# Altium schematic sheet Motor_Controller.SchDoc
size A4; DocumentNumber: 3; SheetNumber: 3; SheetTotal: 4
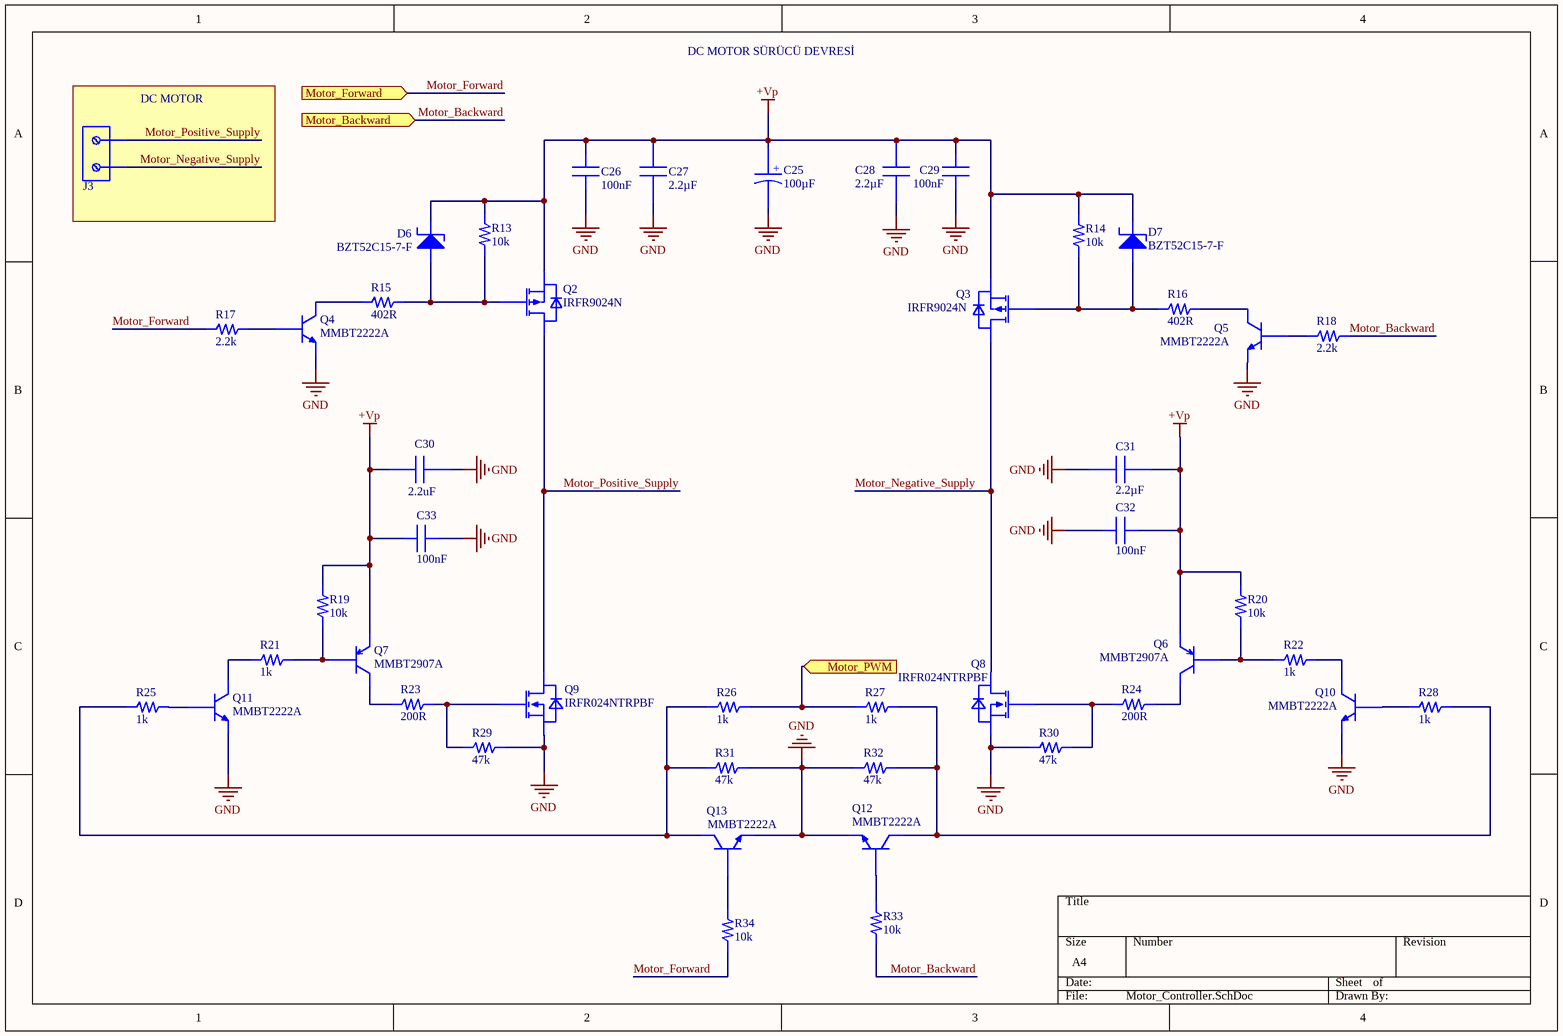
[diagram p0: Motor_Controller.SchDoc]

## Parts
C25  100µF  [CAP_EEHZA1H101P]
C26  100nF  [CL21B104KBCNNNC]
C27  2.2µF  [CAPC3216X180N]
C28  2.2µF  [CAPC3216X180N]
C29  100nF  [CL21B104KBCNNNC]
C30  2.2µF  [CAPC3216X180N]  (value not drawn)
C31  2.2µF  [CAPC3216X180N]
C32  100nF  [CL21B104KBCNNNC]
C33  100nF  [CL21B104KBCNNNC]
D6  BZT52C15-7-F  [DIODE ZENER BZT52C15-7-F]
D7  BZT52C15-7-F  [DIODE ZENER BZT52C15-7-F]
J3  2x1 5mm T.B.  [Terminal Block 2x1]  (value not drawn)
Q2  IRFR9024N  [TO252 (DPAK) IRFR024NTRPBF]
Q3  IRFR9024N  [TO252 (DPAK) IRFR024NTRPBF]
Q4  MMBT2222A  [SOT23-3 MMBT2222A-HT]
Q5  MMBT2222A  [SOT23-3 MMBT2222A-HT]
Q6  MMBT2907A  [TRANS_MMBT2907A]
Q7  MMBT2907A  [TRANS_MMBT2907A]
Q8  IRFR024NTRPBF  [TO252 (DPAK) IRFR024NTRPBF]
Q9  IRFR024NTRPBF  [TO252 (DPAK) IRFR024NTRPBF]
Q10  MMBT2222A  [SOT23-3 MMBT2222A-HT]
Q11  MMBT2222A  [SOT23-3 MMBT2222A-HT]
Q12  MMBT2222A  [SOT23-3 MMBT2222A-HT]
Q13  MMBT2222A  [SOT23-3 MMBT2222A-HT]
R13  10k  [RES 0402 ROYALOHM GENERAL]
R14  10k  [RES 0402 ROYALOHM GENERAL]
R15  402R  [CHIP RES 0805 1k]
R16  402R  [CHIP RES 0805 1k]
R17  2.2k  [RES 0402 ROYALOHM GENERAL]
R18  2.2k  [RES 0402 ROYALOHM GENERAL]
R19  10k  [RES 0402 ROYALOHM GENERAL]
R20  10k  [RES 0402 ROYALOHM GENERAL]
R21  1k  [RES 0402 ROYALOHM GENERAL]
R22  1k  [RES 0402 ROYALOHM GENERAL]
R23  200R  [CHIP RES 0805 1k]
R24  200R  [CHIP RES 0805 1k]
R25  1k  [RES 0402 ROYALOHM GENERAL]
R26  1k  [RES 0402 ROYALOHM GENERAL]
R27  1k  [RES 0402 ROYALOHM GENERAL]
R28  1k  [RES 0402 ROYALOHM GENERAL]
R29  47k  [RES 0402 ROYALOHM GENERAL]
R30  47k  [RES 0402 ROYALOHM GENERAL]
R31  47k  [RES 0402 ROYALOHM GENERAL]
R32  47k  [RES 0402 ROYALOHM GENERAL]
R33  10k  [RES 0402 ROYALOHM GENERAL]
R34  10k  [RES 0402 ROYALOHM GENERAL]

## Blocks framed on the sheet
DC MOTOR: J3

## Ports
Motor_Backward (in, see MCU[1D]), Motor_Forward (in, see MCU[1D]), Motor_PWM (in, see MCU[2B])

## Nets
+Vp: C25.1 C26.2 C27.2 C28.2 C29.2 C30.1 C31.2 C32.2 C33.1 D6.2(Cathode) D7.2(Cathode) Q2.3(Source) Q3.3(Source) Q6.2(Emitter) Q7.2(Emitter) R13.2 R14.2 R19.2 R20.2
GND: C25.2 C26.1 C27.1 C28.1 C29.1 C30.2 C31.1 C32.1 C33.2 Q4.2(Emitter) Q5.2(Emitter) Q8.3(Source) Q9.3(Source) Q10.2(Emitter) Q11.2(Emitter) Q12.2(Emitter) Q13.2(Emitter) R29.2 R30.1 R31.2 R32.1
Motor_Backward: R18.2 R33.1 ; port Motor_Backward
Motor_Forward: R17.1 R34.1 ; port Motor_Forward
Motor_Negative_Supply: J3.2 Q3.4(Drain) Q8.4(Drain)
Motor_Positive_Supply: J3.1 Q2.4(Drain) Q9.4(Drain)
Motor_PWM: R26.2 R27.1 ; port Motor_PWM
NetD6_1: D6.1(Anode) Q2.1(Gate) R13.1 R15.2
NetD7_1: D7.1(Anode) Q3.1(Gate) R14.1 R16.1
NetQ4_1: Q4.1(Base) R17.2
NetQ4_3: Q4.3(Collector) R15.1
NetQ5_1: Q5.1(Base) R18.1
NetQ5_3: Q5.3(Collector) R16.2
NetQ6_1: Q6.1(Base) R20.1 R22.1
NetQ6_3: Q6.3(Collector) R24.2
NetQ7_1: Q7.1(Base) R19.1 R21.2
NetQ7_3: Q7.3(Collector) R23.1
NetQ8_1: Q8.1(Gate) R24.1 R30.2
NetQ9_1: Q9.1(Gate) R23.2 R29.1
NetQ10_1: Q10.1(Base) R28.1
NetQ10_3: Q10.3(Collector) R22.2
NetQ11_1: Q11.1(Base) R25.2
NetQ11_3: Q11.3(Collector) R21.1
NetQ12_1: Q12.1(Base) R33.2
NetQ12_3: Q12.3(Collector) R27.2 R28.2 R32.2
NetQ13_1: Q13.1(Base) R34.2
NetQ13_3: Q13.3(Collector) R25.1 R26.1 R31.1

## Notes on the sheet
- DC MOTOR SÜRÜCÜ DEVRESİ
- (in symbol CAP 100µF) +
- (in symbol CAP 1206 2.2µF) 2.2uF

## Library data of the parts
C25 = CAP 100µF: CAP.EL.100µF 50V 10.5x10.5 105C SMD; Manufacturer: Panasonic; Manufacturer Code: EEH-ZA1H101P; Capacitor Type: Hybrid; Voltage Value: 50VDC; Tolerance: ±20 %; Surge Current: 2 A; Capacitance: 100µF; Package: Radial; Operating Temp.: -55 °C ~ +105 °C; Manufacturer Site: https://www.ozdisan.com/p/aluminyum-kapasitorler-180/panasoniceurope-eehza1h101p-614536
C26 C29 C32 C33 = CAP 0805 100nF: MLCC 0805 100nF 50VDC ±10% X7R; Manufacturer: SAMSUNG; Capacitance: 100nF; Voltage Rating: 50VDC; Dielectric: X7R; Package Size: 0805; Operating Temp.: -55 °C ~ +125 °C; Tolerance: ±10 %; Manufacturer Site: https://www.ozdisan.com/p/smt-smd-ve-mlcc-kapasitorler-184/samsung-cl21b104kbcnnnc-14777; Manufacturer Code: CL21B104KBCNNNC
C27 C28 C30 C31 = CAP 1206 2.2µF: MLCC 1206 2.2µF 50VDC ±10% X7R; Manufacturer: SAMSUNG; Manufacturer Code: CL31B225KBHVPNE; Capacitance: 2.2µF; Voltage Value: 50VDC; Tolerance: ±10 %; Dielectric: X7R; Operating Temp.: -55 °C ~ +125 °C; Manufacturer Site: https://www.ozdisan.com/p/smt-smd-ve-mlcc-kapasitorler-184/samsung-cl31b225kbhvpne-523411
D6 D7 = DIODE ZENER 15V BZT52C15-7-F: DIODE ZENER 500mW 15V ±5% SOD123 SMT; pin to pad: 1>A 2>C; Manufacturer: DIODES; Reverse Current: 100 nA; Manufacturer Site: https://www.ozdisan.com/p/zener-diyotlar-390/diodes-bzt52c15-7-f-444889; Zener Voltage: 15V; Operating Temp.: -65 °C ~ +150 °C; Tolerance: ±5 %; Power: 500 mW; Manufacturer Code: BZT52C15-7-F
J3 = Terminal Block 2x1: TERM.BLK.5.00MM 2P PCB TYPE 0 BOY BLUE; Manufacturer: DEGSON; Manufacturer Code: DG301-5.0-02P-12-00AH; Voltage Rating: 300V; Current Rating: 15A; Mounting Type: THT; Number of Pins: 2; Operating Temp.: -40°C~+105 °C; Manufacturer Site: https://www.ozdisan.com/p/pcb-klemensler-410/degson-dg301-5-0-02p-12-00ah-349366
Q2 Q3 = P Channel Mosfet IRFR9024N: MOSFET DIS.11A 55V P-CH TO252(DPAK) HEXFET SMT; Manufacturer: INFINEON; Manufacturer Code: IRFR9024NTRPBF; Power: 38 W; Current: 11 A; Operating Temp.: -55 °C ~ +150 °C; Voltage: 55 V; Fet Type: P-CH; Package: TO252 (DPAK); Manufacturer Site: https://www.ozdisan.com/p/discrete-mosfetler-435/infineon-irfr9024ntrpbf-474342
Q4 Q5 Q10-Q13 = NPN Transistor MMBT2222A-HT: TRANSISTOR DIS.600mA 40V NPN SOT23 EPITAXIAL SMT; Manufacturer: HOTTECH; Ic (Collector Current): 600 mA; Power: 250 mW; Channel: NPN; Vce ( Collector Emitter Voltage): 40V; Operating Temp.: -55 °C ~ +150 °C; Manufacturer Site: https://www.ozdisan.com/p/discrete-transistorler-442/hottech-mmbt2222a-ht-462248; Manufacturer Code: MMBT2222A-HT
Q6 Q7 = PNP Transistor MMBT2907A: TRANSISTOR DIS.600mA 60V PNP SOT23 GEN. SMT; Manufacturer: PANJIT; Manufacturer Code: MMBT2907A_R1_00001; Ic (Collector Current): 600 mA; Power: 225 mW; Channel: PNP; Vce (Collector Emitter Voltage): 60V; Operating Temp.: -55 °C ~ +150 °C; Manufacturer Site: https://www.ozdisan.com/p/discrete-transistorler-442/panjit-mmbt2907a-r1-00001-494451
Q8 Q9 = N Channel Mosfet IRFR024NTRPBF: MOSFET DIS.17A 55V N-CH TO252(DPAK) HEXFET SMT; Manufacturer: IR; Current: 17 A; Power: 45W; Operating Temp.: -55 °C ~ +175 °C; Fet Type: N - CH; Package: TO252 (DPAK); Voltage: 55 V; Manufacturer Site: https://www.ozdisan.com/p/discrete-mosfetler-435/ir-irfr024ntrpbf-372863; Manufacturer Code: IRFR024NTRPBF
R13 R14 R19 R20 R33 R34 = RES 0402 10k: RES.(1005) 0402 10K Ohms 5% 1/16W 100PPM 0402WGJ0103TCE; Manufacturer: ROYALOHM; Tolerance: %5; Voltage Rating: 5V; Manufacturer Site: https://www.ozdisan.com/p/smt-smd-ve-cip-direncler-194/royalohm-0402wgj0103tce-362331; Package Size: 0402; Manufacturer Code: 0402WGJ0103TCE; Power: 1/16W; Resistance Value: 10k Ohms
R15 R16 = RES 0805 402 Ohms 0402WGF4020TCE: RES.(2012) 0805 402 Ohms 1% 1/8W-S 100PPM 0805S8F4020T5E; Manufacturer: ROYALOHM; Max Working Current: 2A; Max Working Voltage: 150V; Power: 1/8 W; Manufacturer Code: 0805S8F4020T5E; Manufacturer Site: https://www.ozdisan.com/p/smt-smd-ve-cip-direncler-194/royalohm-0805s8f4020t5e-505424; Package / Case: 0805; Resistance Value: 402 Ohms; Tolerance: ±1 %; Mounting Type: SMT
R17 R18 = RES 0402 2.2k 0402WGF2201TCE: RES. 0805 2.2k Ohms 1% 1/8W-S 100PPM 0402WGF2201TCE; Manufacturer Code: 0805S8F2201T5E; Manufacturer: ROYALOHM; Tolerance: %1; Voltage Rating: 50V; Power: 1/16 W; Manufacturer Site: https://www.ozdisan.com/p/smt-smd-ve-cip-direncler-194/royalohm-0402wgf2201tce-359862; Package Size: 0402; Resistance Value: 2.2k Ohms
R21 R22 R25-R28 = RES 0402 1k HP02WAF1001TCE: RES.(1005) 0402 1K Ohms 1% 1/10W / HP02WAF1001TCE; Manufacturer: ROYALOHM; Voltage Rating: 50V; Resistance Value: 1k Ohms; Tolerance: ±1 %; Package Size: 0402; Manufacturer Code: HP02WAF1001TCE; Manufacturer Site: https://www.ozdisan.com/p/smt-smd-ve-cip-direncler-194/royalohm-hp02waf1001tce-603902
R23 R24 = RES 0805 200Ohms 0805S8J0201T5E: RES.(2012) 0805 200 Ohms 5% 1/8W-S 100PPM / 0805S8J0201T5E; Manufacturer: ROYALOHM; Max Working Current: 2A; Max Working Voltage: 150V; ComponentLink1Description: New link; ComponentLink1URL: *; Mounting Type: SMT; Tolerance: ±5 %; Resistance Value: 200 Ohms; Package / Case: 0805; Manufacturer Site: https://www.ozdisan.com/p/smt-smd-ve-cip-direncler-194/royalohm-0805s8j0201t5e-39150; Manufacturer Code: 0805S8J0201T5E
R29-R32 = RES 0402 47k HP02WAF4702TCE: RES.(1005) 0402 47K Ohms 1% 1/10W / HP02WAF4702TCE; Manufacturer: ROYALOHM; Voltage Rating: 50V; Max Working Current: 1A; Manufacturer Site: https://www.ozdisan.com/p/smt-smd-ve-cip-direncler-194/royalohm-0805s8j0473t5e-29835; Tolerance: ±1 %; Package Size: 0402; Manufacturer Code: HP02WAF4702TCE; Resistance Value: 47k Ohms